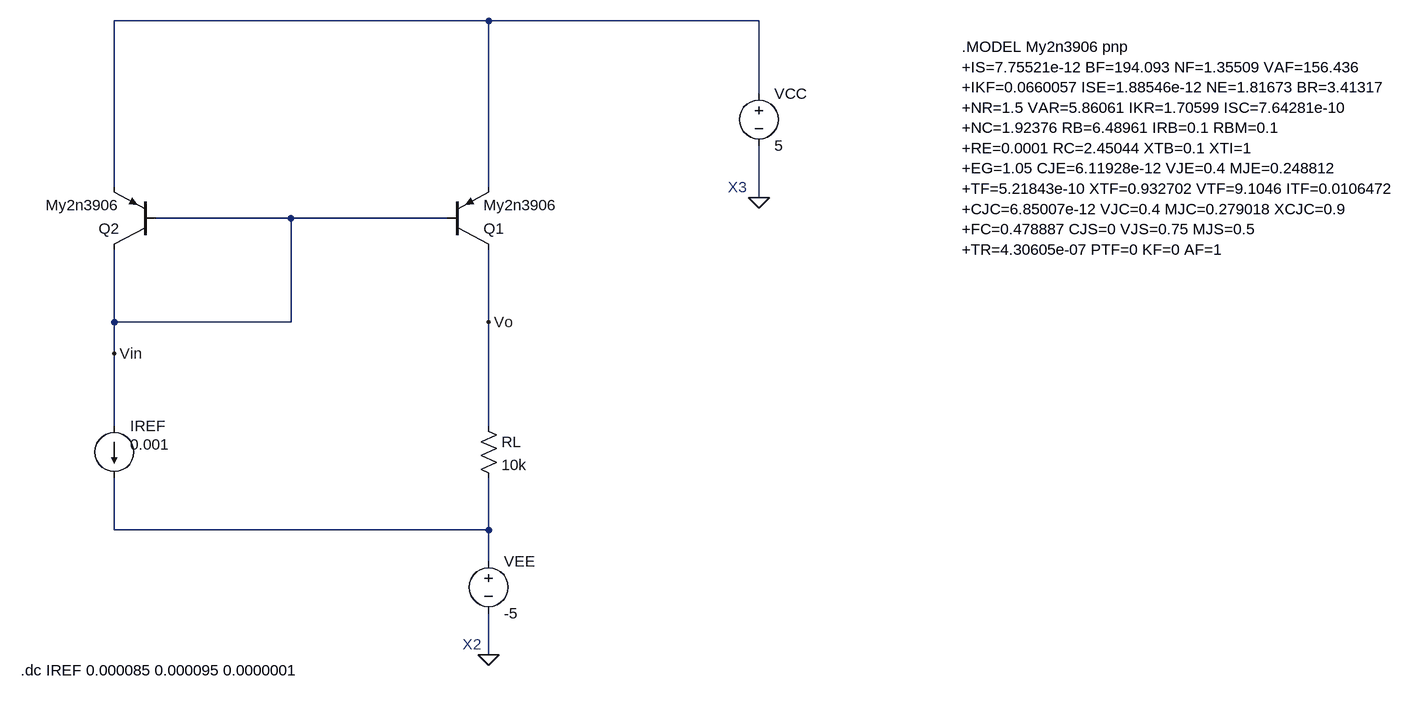
[diagram p0: schematic A.asc]
A.asc, the LTspice schematic file:
Version 4
SHEET 1 1696 680
WIRE 240 -640 -336 -640
WIRE 656 -640 240 -640
WIRE 656 -528 656 -640
WIRE -336 -384 -336 -640
WIRE 240 -384 240 -640
WIRE 656 -368 656 -448
WIRE -64 -336 -272 -336
WIRE 176 -336 -64 -336
WIRE -336 -176 -336 -288
WIRE -64 -176 -64 -336
WIRE -64 -176 -336 -176
WIRE 240 -176 240 -288
WIRE -336 -128 -336 -176
WIRE -336 -16 -336 -128
WIRE 240 -16 240 -176
WIRE -336 144 -336 64
WIRE 240 144 240 64
WIRE 240 144 -336 144
WIRE 240 192 240 144
WIRE 240 336 240 272
FLAG 240 336 0
FLAG 656 -368 0
FLAG 240 -176 Vo
FLAG -336 -128 Vin
SYMBOL voltage 240 176 R0
WINDOW 123 0 0 Left 0
WINDOW 39 0 0 Left 0
SYMATTR InstName VEE
SYMATTR Value -5
SYMBOL res 224 -32 R0
SYMATTR InstName RL
SYMATTR Value 10k
SYMBOL pnp 176 -288 M180
SYMATTR InstName Q1
SYMATTR Value My2n3906
SYMBOL pnp -272 -288 R180
SYMATTR InstName Q2
SYMATTR Value My2n3906
SYMBOL voltage 656 -544 R0
WINDOW 123 0 0 Left 0
WINDOW 39 0 0 Left 0
SYMATTR InstName VCC
SYMATTR Value 5
SYMBOL current -336 -16 R0
WINDOW 3 24 28 Left 2
WINDOW 123 0 0 Left 0
WINDOW 39 0 0 Left 0
SYMATTR InstName IREF
SYMATTR Value 0.001
TEXT 608 -384 Left 2 ;X3
TEXT 968 -600 Left 2 !.MODEL My2n3906 pnp\n+IS=7.75521e-12 BF=194.093 NF=1.35509 VAF=156.436\n+IKF=0.0660057 ISE=1.88546e-12 NE=1.81673 BR=3.41317\n+NR=1.5 VAR=5.86061 IKR=1.70599 ISC=7.64281e-10\n+NC=1.92376 RB=6.48961 IRB=0.1 RBM=0.1\n+RE=0.0001 RC=2.45044 XTB=0.1 XTI=1\n+EG=1.05 CJE=6.11928e-12 VJE=0.4 MJE=0.248812\n+TF=5.21843e-10 XTF=0.932702 VTF=9.1046 ITF=0.0106472\n+CJC=6.85007e-12 VJC=0.4 MJC=0.279018 XCJC=0.9\n+FC=0.478887 CJS=0 VJS=0.75 MJS=0.5\n+TR=4.30605e-07 PTF=0 KF=0 AF=1
TEXT 200 320 Left 2 ;X2
TEXT -480 360 Left 2 !.dc IREF 0.000085 0.000095 0.0000001

The netlist it stands for:
* A.asc
VEE N002 0 -5
RL Vo N002 10k
Q1 Vo Vin N001 0 My2n3906
Q2 Vin Vin N001 0 My2n3906
VCC N001 0 5
IREF Vin N002 0.001
.model NPN NPN
.model PNP PNP
.lib standard.bjt
* X3
.MODEL My2n3906 pnp
+IS=7.75521e-12 BF=194.093 NF=1.35509 VAF=156.436
+IKF=0.0660057 ISE=1.88546e-12 NE=1.81673 BR=3.41317
+NR=1.5 VAR=5.86061 IKR=1.70599 ISC=7.64281e-10
+NC=1.92376 RB=6.48961 IRB=0.1 RBM=0.1
+RE=0.0001 RC=2.45044 XTB=0.1 XTI=1
+EG=1.05 CJE=6.11928e-12 VJE=0.4 MJE=0.248812
+TF=5.21843e-10 XTF=0.932702 VTF=9.1046 ITF=0.0106472
+CJC=6.85007e-12 VJC=0.4 MJC=0.279018 XCJC=0.9
+FC=0.478887 CJS=0 VJS=0.75 MJS=0.5
+TR=4.30605e-07 PTF=0 KF=0 AF=1
* X2
.dc IREF 0.000085 0.000095 0.0000001
.backanno
.end

* Results of the author's LTspice run, read from the files saved beside the schematic
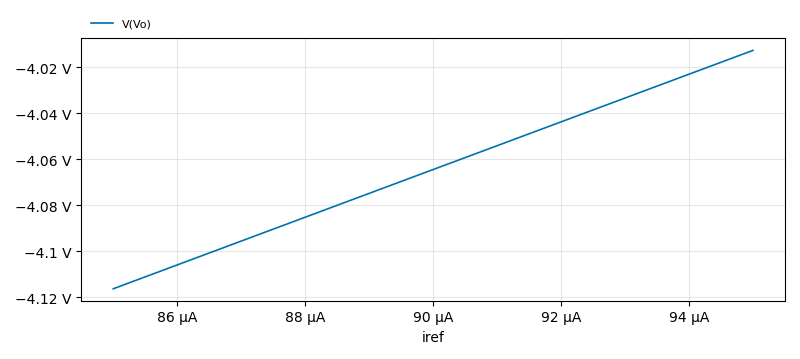
[diagram p1: DC transfer characteristic of A.asc, plotted from the saved traces]
* DC transfer characteristic, 1 run:
*   V(Vo): -4.116 V at iref=85 µA, -4.013 V at iref=95 µA, min -4.116 V, max -4.013 V